# Altium schematic sheet Clock_Led7_23.SchDoc
size A3; SheetNumber: 1; SheetTotal: 1
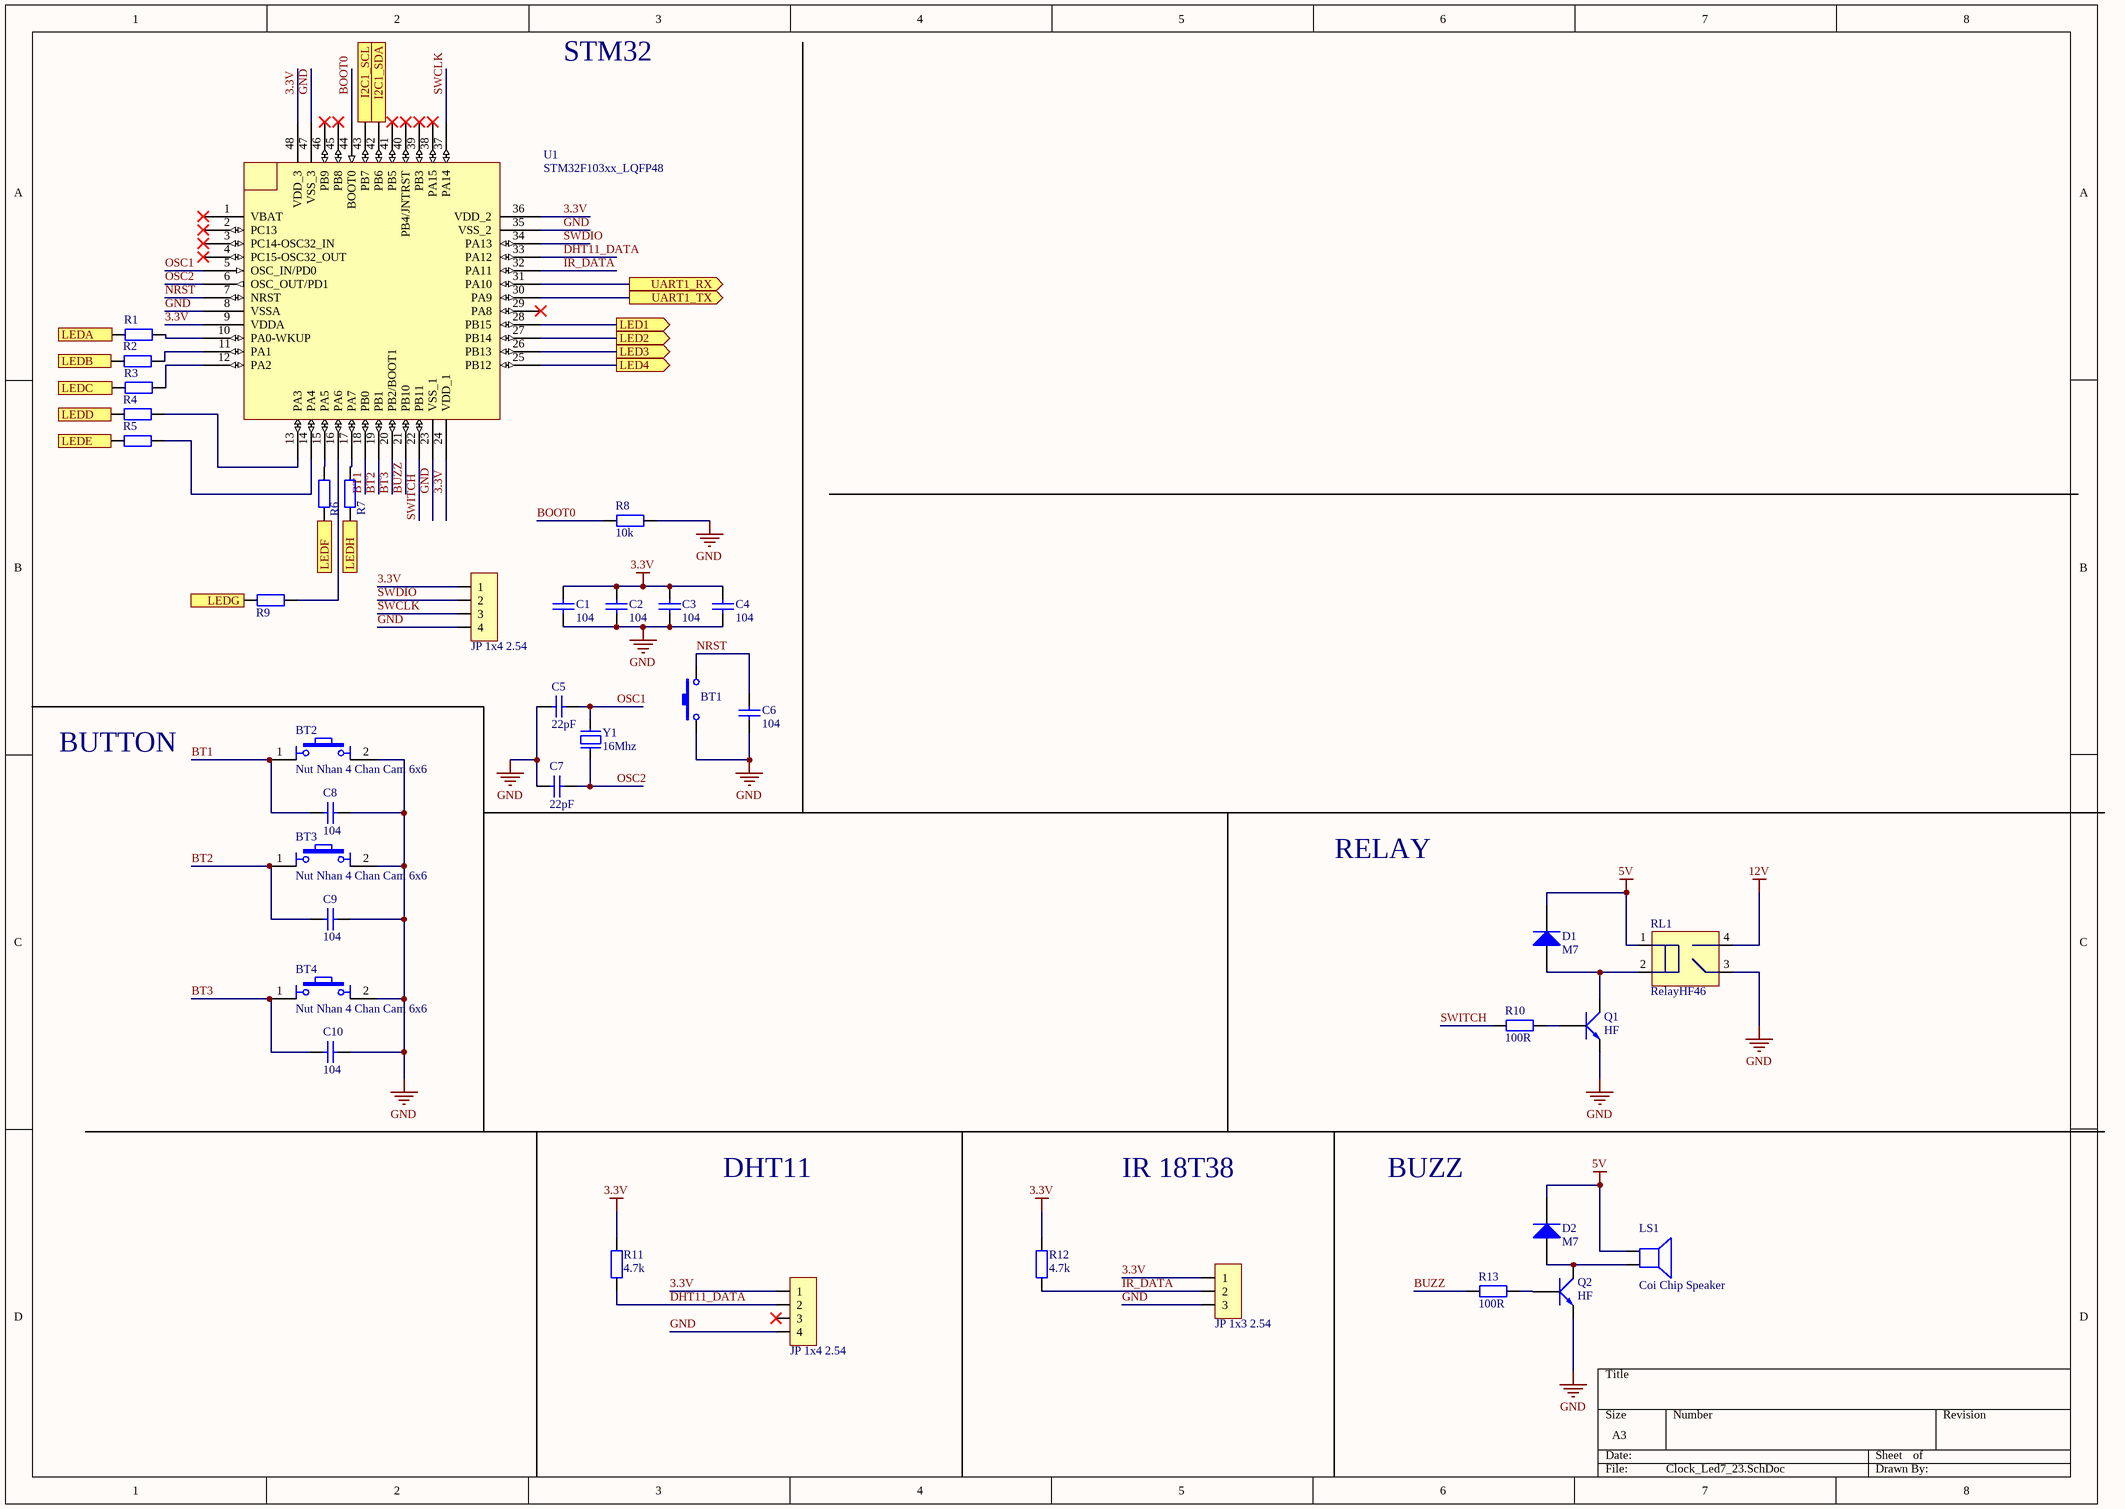
[diagram p0: Clock_Led7_23.SchDoc]

## Parts
BT1  Nut Nhan 2 Chan SMD 3x6x2.5  [Nut Nhan 2 Chan SMD 3x6x2.5]  (value not drawn)
BT2  Nut Nhan 4 Chan Cam 6x6  [Nut Nhan 4 Chan Cam 6x6]
BT3  Nut Nhan 4 Chan Cam 6x6  [Nut Nhan 4 Chan Cam 6x6]
BT4  Nut Nhan 4 Chan Cam 6x6  [Nut Nhan 4 Chan Cam 6x6]
C1  104  [tu 0805]
C2  104  [tu 0805]
C3  104  [tu 0805]
C4  104  [tu 0805]
C5  22pF  [tu 0805]
C6  104  [tu 0805]
C7  22pF  [tu 0805]
C8  104  [tu 0805]
C9  104  [tu 0805]
C10  104  [tu 0805]
D1  M7  [DIODE SMA]
D2  M7  [DIODE SMA]
JP1  JP 1x4 2.54  [JP 1x4 DT]
JP2  JP 1x3 2.54  [JP 1x3 CT]
JP3  JP 1x4 2.54  [JP 1x4 CT]
LS1  Coi Chip Speaker  [Coi Chip Speacker]
Q1  HF  [SOT23]
Q2  HF  [SOT23]
R1  100R  [tro smd 0805]  (value not drawn)
R2  100R  [tro smd 0805]  (value not drawn)
R3  100R  [tro smd 0805]  (value not drawn)
R4  100R  [tro smd 0805]  (value not drawn)
R5  100R  [tro smd 0805]  (value not drawn)
R6  100R  [tro smd 0805]  (value not drawn)
R7  100R  [tro smd 0805]  (value not drawn)
R8  10k  [tro smd 0805]
R9  100R  [tro smd 0805]  (value not drawn)
R10  100R  [tro smd 0805]
R11  4.7k  [tro smd 0805]
R12  4.7k  [tro smd 0805]
R13  100R  [tro smd 0805]
RL1  RelayHF46  [Relay 4 chan HF46F]
U1  STM32F103xx_LQFP48  [STM32_LQPF48]
Y1  16Mhz  [Thach Anh 2 chan SMD]

## Ports
I2C1_SCL (out), I2C1_SDA (out), LED1 (out), LED2 (out), LED3 (out), LED4 (out), LEDA (out), LEDB (out), LEDC (out), LEDD (out), LEDE (out), LEDF (out), LEDG (out), LEDH (out), UART1_RX (out), UART1_TX (out)

## Nets
3.3V: C1.1 C2.1 C3.1 C4.1 JP1.1 JP2.1 JP3.1 R11.2 R12.2 U1.9(VDDA) U1.24(VDD_1) U1.36(VDD_2) U1.48(VDD_3)
5V: D1.2(K) D2.2(K) LS1.1 RL1.1
12V: RL1.4(AC/DC)
GND: BT1.1 BT2.2 BT3.2 BT4.2 C1.2 C2.2 C3.2 C4.2 C5.2 C6.2 C7.1 C8.2 C9.2 C10.2 JP1.4 JP2.3 JP3.4 Q1.2(E) Q2.2(E) R8.1 RL1.3(AC/DC) U1.8(VSSA) U1.23(VSS_1) U1.35(VSS_2) U1.47(VSS_3)
BOOT0: R8.2 U1.44(BOOT0)
BT1: BT2.1 C8.1 U1.18(PB0)
BT2: BT3.1 C9.1 U1.19(PB1)
BT3: BT4.1 C10.1 U1.20(PB2/BOOT1)
BUZZ: R13.1 U1.21(PB10)
DHT11_DATA: JP3.2 R11.1 U1.33(PA12)
I2C1_SCL: U1.43(PB7) ; port I2C1_SCL
I2C1_SDA: U1.42(PB6) ; port I2C1_SDA
IR_DATA: JP2.2 R12.1 U1.32(PA11)
LED1: U1.28(PB15) ; port LED1
LED2: U1.27(PB14) ; port LED2
LED3: U1.26(PB13) ; port LED3
LED4: U1.25(PB12) ; port LED4
LEDA: R1.1 ; port LEDA
LEDB: R2.1 ; port LEDB
LEDC: R3.1 ; port LEDC
LEDD: R4.1 ; port LEDD
LEDE: R5.1 ; port LEDE
LEDF: R6.1 ; port LEDF
LEDG: R9.2 ; port LEDG
LEDH: R7.1 ; port LEDH
NRST: BT1.2 C6.1 U1.7(NRST)
OSC1: C5.1 U1.5(OSC_IN/PD0) Y1.2
OSC2: C7.2 U1.6(OSC_OUT/PD1) Y1.1
SWCLK: JP1.3 U1.37(PA14)
SWDIO: JP1.2 U1.34(PA13)
SWITCH: R10.1 U1.22(PB11)
UART1_RX: U1.31(PA10) ; port UART1_RX
UART1_TX: U1.30(PA9) ; port UART1_TX
NetD1_1: D1.1(A) Q1.3(C) RL1.2
NetD2_1: D2.1(A) LS1.2 Q2.3(C)
NetQ1_1: Q1.1(B) R10.2
NetQ2_1: Q2.1(B) R13.2
NetR1_2: R1.2 U1.10(PA0-WKUP)
NetR2_2: R2.2 U1.11(PA1)
NetR3_2: R3.2 U1.12(PA2)
NetR4_2: R4.2 U1.13(PA3)
NetR5_2: R5.2 U1.14(PA4)
NetR6_2: R6.2 U1.15(PA5)
NetR7_2: R7.2 U1.17(PA7)
NetR9_1: R9.1 U1.16(PA6)

Not connected (* = marked no-connect by the designer): JP3 3*; U1 1(VBAT)* 2(PC13)* 3(PC14-OSC32_IN)* 4(PC15-OSC32_OUT)* 29(PA8)* 38(PA15)* 39(PB3)* 40(PB4/JNTRST)* 41(PB5)* 45(PB8)* 46(PB9)*

## Notes on the sheet
- STM32
- BUTTON
- RELAY
- DHT11
- IR 18T38
- BUZZ

## Library data of the parts
BT1 = Nut Nhan 2 Chan SMD 3x6x2.5: Ma_Hang: MH001036; Ten: Nút Nhấn 2 Chân 3x6x2.5MM SMD
BT2-BT4 = Nut Nhan 4 Chan Cam 6x6: Nut Nhan 4 Chan 6x6mm; Ten: Nút Nhấn 4 Chân 6x6x5MM DIP; Ma_Hang: MH004584
C1-C4 C6 C8-C10 = Tu 0805 104 50V 10%: Dán; Don_Vi: Con; So_Chan: 2; Ten_Linh_Kien: Tụ 0805 104-100nF 10% 50V; Ma_Hang: MH004551; Chung_Loai: Dán; Kieu_Chan: *
C5 C7 = Tu 0805 22pF 50V 10%: Dán; Don_Vi: Con; So_Chan: 2; Ten_Linh_Kien: Tụ 0805 22P 10% 50V; Ma_Hang: MH004560; Chung_Loai: Dán; Kieu_Chan: *
D1 D2 = Diode M7 ( 4007 ): Dán; Don_Vi: Con; Ten_Linh_Kien: Diode M7 1N4007 SMD 1A 1000V; Ma_Hang: MH000944; Chung_Loai: Dán; Ghi_Chu: *
JP1 = JP 1x4 2.54 Duc Thang: Cắm; Ten_Linh_Kien: Jump Đơn Đực 2.54MM 1x40P Thẳng 11MM; Don_Vi: Con; Ma_Hang: MH000903; Ghi_Chu: *; Kieu_Chan: *; Chung_Loai: Cắm
JP2 = JP 1x3 2.54 Cai Thang: Cắm; Ten_Linh_Kien: Jump Đơn Cái 2.54MM 1x20P Thẳng; Don_Vi: Con; Ma_Hang: MH004006; Ghi_Chu: *; Kieu_Chan: *; Chung_Loai: Cắm
JP3 = JP 1x4 2.54 Cai Thang: Cắm; Ten_Linh_Kien: Jump Đơn Cái 2.54MM 1x20P Thẳng; Don_Vi: Con; Ma_Hang: MH004006; Ghi_Chu: *; Kieu_Chan: *; Chung_Loai: Cắm
LS1 = Coi Chip Speaker: Còi chip
Q1 Q2 = C1815 HF SMD: NPN transistor; Value: C9014
R1-R7 R9 R10 R13 = Tro 0805 5% 100R: Dán; Don_Vi: Con; So_Chan: 2; Ten_Linh_Kien: Trở 0805 5% 100R; Ma_Hang: MH005251; Chung_Loai: Dán; Kieu_Chan: *
R8 = Tro 0805 5% 10k: Dán; Don_Vi: Con; So_Chan: 2; Ten_Linh_Kien: Trở 0805 5% 10k; Ma_Hang: MH005239; Chung_Loai: Dán; Kieu_Chan: *
R11 R12 = Tro 0805 5% 4.7k: Dán; Don_Vi: Con; So_Chan: 2; Ten_Linh_Kien: Trở 0805 5% 4.7k; Ma_Hang: MH005307; Chung_Loai: Dán; Kieu_Chan: *
RL1 = Relay 4 chan HF46F: Ten: Relay 5V5A HF46F-G 5-HS1; Ma_Hang: MH003879
Y1 = Thach Anh 2 chan SMD: Crystal For all Crystal 2pin.; Value: 4Mhz
U1 = STM32F103xx_LQFP48: Published: 30-May-2008; DatasheetVersion: rev6, Mar-2008; PackageVersion: Mar-2008; PackageReference: LQFP48; Publisher: Altium Limited; PackageDescription: 48-Pin Low-Profile Quad Flat Pack, 7 x 7 mm Body, 0.5 mm Pitch (LQFP48); ComponentLink1Description: Manufacturer Link; ComponentLink1URL: www.st.com/stm32; ComponentLink2Description: Datasheet; ComponentLink2URL: http://www.st.com/stonline/products/literature/ds/13587.pdf